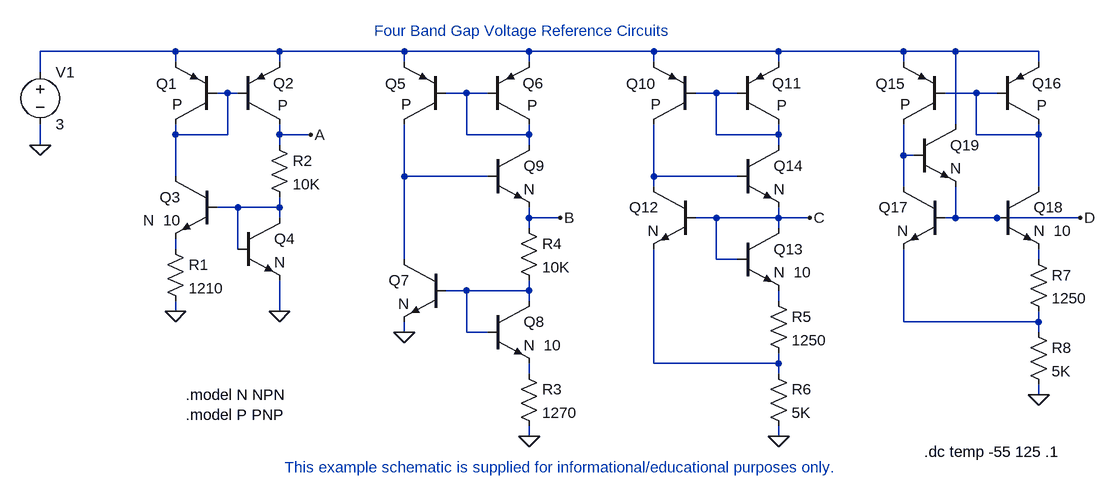
[diagram p0: schematic BandGaps.asc]
BandGaps.asc, the LTspice schematic file:
Version 4
SHEET 1 2072 804
WIRE 496 16 288 16
WIRE 656 16 496 16
WIRE 848 16 656 16
WIRE 1040 16 848 16
WIRE 1232 16 1040 16
WIRE 1424 16 1232 16
WIRE 1616 16 1424 16
WIRE 1696 16 1616 16
WIRE 1824 16 1696 16
WIRE 496 32 496 16
WIRE 656 32 656 16
WIRE 848 32 848 16
WIRE 1040 32 1040 16
WIRE 1232 32 1232 16
WIRE 1424 32 1424 16
WIRE 1616 32 1616 16
WIRE 1824 32 1824 16
WIRE 288 48 288 16
WIRE 576 80 560 80
WIRE 592 80 576 80
WIRE 944 80 912 80
WIRE 976 80 944 80
WIRE 1328 80 1296 80
WIRE 1360 80 1328 80
WIRE 1728 80 1680 80
WIRE 1760 80 1728 80
WIRE 1696 128 1696 16
WIRE 496 144 496 128
WIRE 576 144 576 80
WIRE 576 144 496 144
WIRE 656 144 656 128
WIRE 704 144 656 144
WIRE 944 144 944 80
WIRE 1040 144 1040 128
WIRE 1040 144 944 144
WIRE 1328 144 1328 80
WIRE 1424 144 1424 128
WIRE 1424 144 1328 144
WIRE 1728 144 1728 80
WIRE 1824 144 1824 128
WIRE 1824 144 1728 144
WIRE 288 160 288 128
WIRE 656 160 656 144
WIRE 1040 160 1040 144
WIRE 1424 160 1424 144
WIRE 1616 176 1616 128
WIRE 1632 176 1616 176
WIRE 496 208 496 144
WIRE 848 208 848 128
WIRE 976 208 848 208
WIRE 1232 208 1232 128
WIRE 1360 208 1232 208
WIRE 1232 224 1232 208
WIRE 1616 224 1616 176
WIRE 1824 224 1824 144
WIRE 592 256 560 256
WIRE 656 256 656 240
WIRE 656 256 592 256
WIRE 656 272 656 256
WIRE 1040 272 1040 256
WIRE 1088 272 1040 272
WIRE 1328 272 1296 272
WIRE 1424 272 1424 256
WIRE 1424 272 1328 272
WIRE 1472 272 1424 272
WIRE 1696 272 1696 224
WIRE 1696 272 1680 272
WIRE 1760 272 1696 272
WIRE 1888 272 1760 272
WIRE 1040 288 1040 272
WIRE 1424 288 1424 272
WIRE 496 320 496 304
WIRE 592 320 592 256
WIRE 848 336 848 208
WIRE 1328 336 1328 272
WIRE 1360 336 1328 336
WIRE 1824 336 1824 320
WIRE 944 384 912 384
WIRE 1040 384 1040 368
WIRE 1040 384 944 384
WIRE 1040 400 1040 384
WIRE 1424 400 1424 384
WIRE 496 416 496 400
WIRE 656 416 656 368
WIRE 1616 432 1616 320
WIRE 1824 432 1824 416
WIRE 1824 432 1616 432
WIRE 848 448 848 432
WIRE 944 448 944 384
WIRE 976 448 944 448
WIRE 1824 448 1824 432
WIRE 1232 496 1232 320
WIRE 1424 496 1424 480
WIRE 1424 496 1232 496
WIRE 1040 512 1040 496
WIRE 1424 512 1424 496
WIRE 1824 544 1824 528
WIRE 1040 608 1040 592
WIRE 1424 608 1424 592
FLAG 496 416 0
FLAG 288 160 0
FLAG 656 416 0
FLAG 1040 608 0
FLAG 704 144 A
FLAG 1088 272 B
FLAG 848 448 0
FLAG 1424 608 0
FLAG 1472 272 C
FLAG 1824 544 0
FLAG 1888 272 D
SYMBOL pnp 560 128 R180
WINDOW 0 61 62 Left 0
WINDOW 3 53 31 Left 0
SYMATTR InstName Q1
SYMATTR Value P
SYMBOL pnp 592 128 M180
WINDOW 0 54 63 Left 0
WINDOW 3 61 29 Left 0
SYMATTR InstName Q2
SYMATTR Value P
SYMBOL res 480 304 R0
SYMATTR InstName R1
SYMATTR Value 1210
SYMBOL npn 560 208 M0
SYMATTR InstName Q3
SYMATTR Value N  10
SYMBOL npn 592 272 R0
SYMATTR InstName Q4
SYMATTR Value N
SYMBOL voltage 288 32 R0
SYMATTR InstName V1
SYMATTR Value 3
SYMBOL res 640 144 R0
SYMATTR InstName R2
SYMATTR Value 10K
SYMBOL pnp 912 128 R180
WINDOW 0 61 62 Left 0
WINDOW 3 53 31 Left 0
SYMATTR InstName Q5
SYMATTR Value P
SYMBOL pnp 976 128 M180
WINDOW 0 54 63 Left 0
WINDOW 3 61 29 Left 0
SYMATTR InstName Q6
SYMATTR Value P
SYMBOL res 1024 496 R0
SYMATTR InstName R3
SYMATTR Value 1270
SYMBOL npn 912 336 M0
SYMATTR InstName Q7
SYMATTR Value N
SYMBOL npn 976 400 R0
SYMATTR InstName Q8
SYMATTR Value N  10
SYMBOL res 1024 272 R0
SYMATTR InstName R4
SYMATTR Value 10K
SYMBOL npn 976 160 R0
SYMATTR InstName Q9
SYMATTR Value N
SYMBOL pnp 1296 128 R180
WINDOW 0 61 62 Left 0
WINDOW 3 53 31 Left 0
SYMATTR InstName Q10
SYMATTR Value P
SYMBOL pnp 1360 128 M180
WINDOW 0 54 63 Left 0
WINDOW 3 61 29 Left 0
SYMATTR InstName Q11
SYMATTR Value P
SYMBOL res 1408 384 R0
SYMATTR InstName R5
SYMATTR Value 1250
SYMBOL npn 1296 224 M0
SYMATTR InstName Q12
SYMATTR Value N
SYMBOL npn 1360 288 R0
SYMATTR InstName Q13
SYMATTR Value N  10
SYMBOL res 1408 496 R0
SYMATTR InstName R6
SYMATTR Value 5K
SYMBOL npn 1360 160 R0
SYMATTR InstName Q14
SYMATTR Value N
SYMBOL pnp 1680 128 R180
WINDOW 0 61 62 Left 0
WINDOW 3 53 31 Left 0
SYMATTR InstName Q15
SYMATTR Value P
SYMBOL pnp 1760 128 M180
WINDOW 0 54 63 Left 0
WINDOW 3 61 29 Left 0
SYMATTR InstName Q16
SYMATTR Value P
SYMBOL res 1808 320 R0
SYMATTR InstName R7
SYMATTR Value 1250
SYMBOL npn 1680 224 M0
SYMATTR InstName Q17
SYMATTR Value N
SYMBOL npn 1760 224 R0
SYMATTR InstName Q18
SYMATTR Value N  10
SYMBOL res 1808 432 R0
SYMATTR InstName R8
SYMATTR Value 5K
SYMBOL npn 1632 128 R0
SYMATTR InstName Q19
SYMATTR Value N
TEXT 1648 632 Left 0 !.dc temp -55 125 .1
TEXT 512 544 Left 0 !.model N NPN\n.model P PNP
TEXT 664 656 Left 0 ;This example schematic is supplied for informational/educational purposes only.
TEXT 1032 0 Bottom 0 ;Four Band Gap Voltage Reference Circuits

The netlist it stands for:
* BandGaps.asc
Q1 N002 N002 N001 0 P
Q2 A N002 N001 0 P
R1 N010 0 1210
Q3 N002 N009 N010 0 N  10
Q4 N009 N009 0 0 N
V1 N001 0 3
R2 A N009 10K
Q5 N007 N003 N001 0 P
Q6 N003 N003 N001 0 P
R3 N016 0 1270
Q7 N007 N012 0 0 N
Q8 N012 N012 N016 0 N  10
R4 B N012 10K
Q9 N003 N007 B 0 N
Q10 N008 N004 N001 0 P
Q11 N004 N004 N001 0 P
R5 N013 N015 1250
Q12 N008 C N015 0 N
Q13 C C N013 0 N  10
R6 N015 0 5K
Q14 N004 N008 C 0 N
Q15 N006 N005 N001 0 P
Q16 N005 N005 N001 0 P
R7 N011 N014 1250
Q17 N006 D N014 0 N
Q18 N005 D N011 0 N  10
R8 N014 0 5K
Q19 N001 N006 D 0 N
.model NPN NPN
.model PNP PNP
.lib standard.bjt
.dc temp -55 125 .1
.model N NPN
.model P PNP
* This example schematic is supplied for informational/educational purposes only.
* Four Band Gap Voltage Reference Circuits
.backanno
.end